# Altium schematic sheet Game_Consol_Top.SchDoc: Schematic_Name
size A4; CompanyName: University of Melbourne; DrawnBy: Student_#; Engineer: Your Name Here; Organization: University of Melbourne; DocumentNumber: 1; Revision: 0.1; SheetNumber: 1; SheetTotal: 10; Title_Project: Project_Title
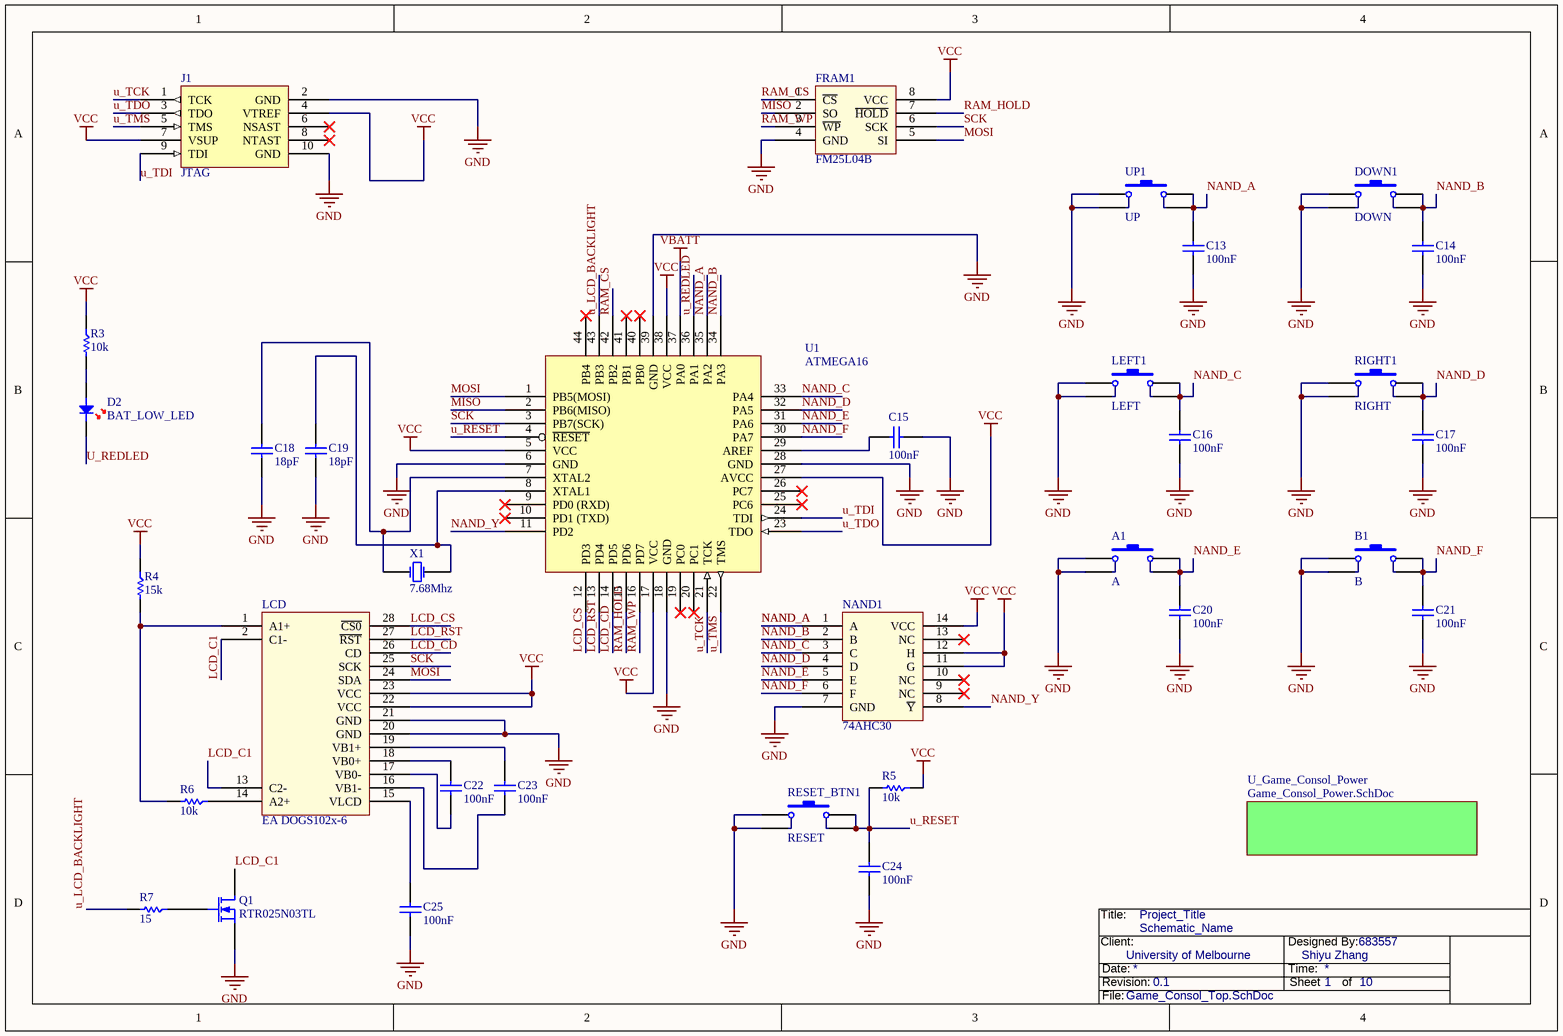
[diagram p0: Game_Consol_Top.SchDoc]

## Parts
A1  A  [SPNO_SMD]
B1  B  [SPNO_SMD]
C13  100nF  [0805]
C14  100nF  [0805]
C15  100nF  [0805]
C16  100nF  [0805]
C17  100nF  [0805]
C18  18pF  [0805]
C19  18pF  [0805]
C20  100nF  [0805]
C21  100nF  [0805]
C22  100nF  [0805]
C23  100nF  [0805]
C24  100nF  [0805]
C25  100nF  [0805]
D2  BAT_LOW_LED  [0805D]
DOWN1  DOWN  [SPNO_SMD]
FRAM1  FM25L04B  [SOIC-8]
J1  JTAG  [BOXEDVERT10]
LCD  EA DOGS102x-6  [EA DOGS102x]
LEFT1  LEFT  [SPNO_SMD]
NAND1  74AHC30  [SOIC-14]
Q1  RTR025N03TL  [SOT23]
R3  10k  [0805]
R4  15k  [0805]
R5  10k  [0805]
R6  10k  [0805]
R7  15  [0805]
RESET_BTN1  RESET  [SPNO_SMD]
RIGHT1  RIGHT  [SPNO_SMD]
U1  ATMEGA16  [QFP-48]
UP1  UP  [SPNO_SMD]
X1  7.68Mhz  [XTAL_FLAT_SMD]

## Sub-sheets
U_Game_Consol_Power = Game_Consol_Power.SchDoc: no entries

## Nets
GND: A1.1 A1.2 B1.1 B1.2 C13.2 C14.2 C15.1 C16.2 C17.2 C18.2 C19.2 C20.2 C21.2 C24.2 C25.2 DOWN1.1 DOWN1.2 FRAM1.4(GND) J1.2(GND) J1.10(GND) LCD.20(GND) LCD.21(GND) LEFT1.1 LEFT1.2 NAND1.7(GND) Q1.2 RESET_BTN1.1 RESET_BTN1.2 RIGHT1.1 RIGHT1.2 U1.6(GND) U1.18(GND) U1.28(GND) U1.39(GND) UP1.1 UP1.2
VBATT: U1.37(PA0)
VCC: FRAM1.8(VCC) J1.4(VTREF) J1.7(VSUP) LCD.22(VCC) LCD.23(VCC) NAND1.11(G) NAND1.12(H) NAND1.14(VCC) R3.1 R4.1 R5.1 U1.5(VCC) U1.17(VCC) U1.27(AVCC) U1.38(VCC)
LCD_C1: LCD.2(C1-) LCD.13(C2-) Q1.3
LCD_CD: LCD.26(CD) U1.14(PD5)
LCD_CS: LCD.28(~{CS0}) U1.12(PD3)
LCD_RST: LCD.27(~{RST}) U1.13(PD4)
MISO: FRAM1.2(SO) U1.2(PB6(MISO))
MOSI: FRAM1.5(SI) LCD.24(SDA) U1.1(PB5(MOSI))
NAND_A: C13.1 NAND1.1(A) U1.35(PA2) UP1.3 UP1.4
NAND_B: C14.1 DOWN1.3 DOWN1.4 NAND1.2(B) U1.34(PA3)
NAND_C: C16.1 LEFT1.3 LEFT1.4 NAND1.3(C) U1.33(PA4)
NAND_D: C17.1 NAND1.4(D) RIGHT1.3 RIGHT1.4 U1.32(PA5)
NAND_E: A1.3 A1.4 C20.1 NAND1.5(E) U1.31(PA6)
NAND_F: B1.3 B1.4 C21.1 NAND1.6(F) U1.30(PA7)
NAND_Y: NAND1.8(~{Y}) U1.11(PD2)
RAM_CS: FRAM1.1(~{CS}) U1.42(PB2)
RAM_HOLD: FRAM1.7(~{HOLD}) U1.15(PD6)
RAM_WP: FRAM1.3(~{WP}) U1.16(PD7)
SCK: FRAM1.6(SCK) LCD.25(SCK) U1.3(PB7(SCK))
u_LCD_BACKLIGHT: R7.2 U1.43(PB3)
u_REDLED: D2.K U1.36(PA1)
u_RESET: C24.1 R5.2 RESET_BTN1.3 RESET_BTN1.4 U1.4(~{RESET})
u_TCK: J1.1(TCK) U1.21(TCK)
u_TDI: J1.9(TDI) U1.24(TDI)
u_TDO: J1.3(TDO) U1.23(TDO)
u_TMS: J1.5(TMS) U1.22(TMS)
NetC15_2: C15.2 U1.29(AREF)
NetC18_1: C18.1 U1.7(XTAL2) X1.1(OSC1)
NetC19_1: C19.1 U1.8(XTAL1) X1.2(OSC2)
NetC22_1: C22.1 LCD.18(VB0+)
NetC22_2: C22.2 LCD.17(VB0-)
NetC23_1: C23.1 LCD.19(VB1+)
NetC23_2: C23.2 LCD.16(VB1-)
NetC25_1: C25.1 LCD.15(VLCD)
NetD2_A: D2.A R3.2
NetLCD_1: LCD.1(A1+) R4.2 R6.2
NetLCD_14: LCD.14(A2+) R6.1
NetQ1_1: Q1.1 R7.1

Not connected (* = marked no-connect by the designer): J1 6(NSAST)* 8(NTAST)*; LCD 3 4 5 6 7 8 9 10 11 12; NAND1 9(NC)* 10(NC)* 13(NC)*; U1 9(PD0_(RXD))* 10(PD1_(TXD))* 19(PC0)* 20(PC1)* 25(PC6)* 26(PC7)* 40(PB0)* 41(PB1)* 44(PB4)*

## Notes on the sheet
- Title:
- Client:
- Date:
- Revision:
- Time:
- Designed By:
- Sheet
- Shiyu Zhang
- of
- 683557
- File:

## Library data of the parts
A1 B1 DOWN1 LEFT1 RESET_BTN1 RIGHT1 UP1 = SW-PB: Push Button Switch; Manufacturer: TE Connectivity; Manufacturer Part Number: FSM4JSMA; Circuit: SPST-NO; Switch Function: Off-Mom; Contact Rating @ Voltage: 0.05A @ 12VDC; Actuator Type: Standard; Actuator Orientation: Top Actuated; Outline: 6.00mm x 6.00mm; Illumination: Non-Illuminated; Operating Force: 160gf; Published: 24-Mar-1999; LatestRevisionDate: 17-Jul-2002; LatestRevisionNote: Re-released for DXP Platform.; PackageReference: SPST-2; Publisher: Altium Limited; PackageDescription: Switch; 2 Leads; Supplier 1: Digi-Key; RoHS: RoHS Compliant; Category: Switches; Stock 1: 30338; Pricing 1: 1=0.28, 10=0.265, 25=0.2256, 50=0.1974, 100=0.1834, 250=0.1622, 500=0.15516, 1000=0.12694, 5000=0.10579 (AUD); Mounting Type: Surface Mount; Termination Style: Gull Wing; Packaging: Bulk; ComponentLink1URL: http://documents.tycoelectronics.com/commerce/DocumentDelivery/DDEController?Action=srchrtrv&DocNm=2-1437565-7&DocType=CD&DocLang=EN; ComponentLink1Description: http://documents.tycoelectronics.com/commerce/DocumentDelivery/DDEController?Action=srchrtrv&DocNm=2-1437565-7&DocType=CD&DocLang=EN; Supplier Part Number 1: 450-1129-ND
C13-C25 = C 0805: Capacitor 100nF; Class I: Passive; Revision: July-2002: Re-released for DXP Platform.
  C13-C17 C20-C25: Value: 100nF
  C18 C19: Value: 18pF
D2 = LED RED: Light Emitting Diode; Manufacturer: Generic Components; Class I: Discrete; Class II: Diode - Switching; Published: 8-Jun-2000; Revision: July-2002: Re-released for DXP Platform.; Publisher: Altium Limited
FRAM1 = FM25L04B: FRAM 4Kb Memory
J1 = JTAG_CON: JTAG ATMEL connector
LCD = EA DOGS102x-6: LCD 102x64-pixel with backlight
NAND1 = 74AHC30: 1 x 8 Input NAND gate
Q1 = MOSFET-N: N-Channel MOSFET; PackageDocument: 1995/1996; Published: 8-Jun-2000; LatestRevisionDate: 17-Jul-2002; LatestRevisionNote: Re-released for DXP Platform.; PackageReference: E3; Publisher: Altium Limited
R3-R7 = R: Resistor
  R3 R5 R6: Value: 10k
  R4: Value: 15k
  R7: Value: 15
U1 = ATMEGA16: ATMEGA16 Microcontroller
X1 = XTAL: Crystal Oscillator; Revision: July-2002: Re-released for DXP Platform.; Digikey: 535-9103-1-ND